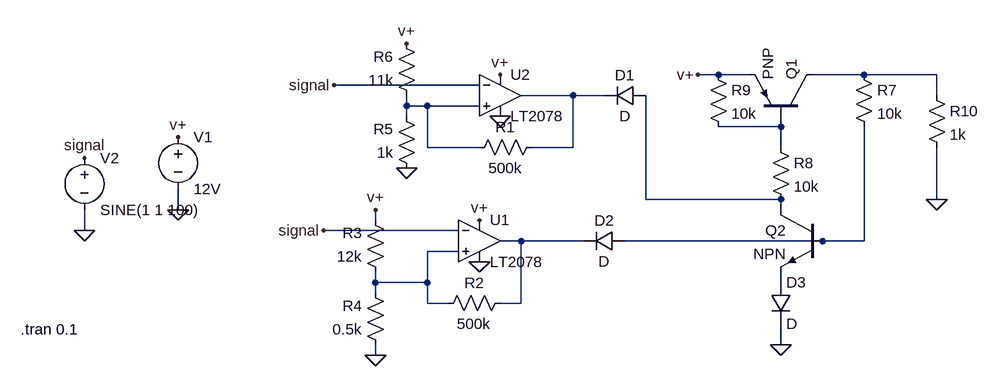
[diagram p0: schematic hystereresisbjt_latch.asc]
hystereresisbjt_latch.asc, the LTspice schematic file:
Version 4
SHEET 1 1124 680
WIRE 672 144 640 144
WIRE 720 144 672 144
WIRE 896 144 816 144
WIRE 1008 144 896 144
WIRE 304 160 80 160
WIRE 448 176 368 176
WIRE 496 176 448 176
WIRE 1008 176 1008 144
WIRE 192 192 192 176
WIRE 224 192 192 192
WIRE 304 192 224 192
WIRE 192 208 192 192
WIRE 768 224 768 208
WIRE 768 224 672 224
WIRE 224 256 224 192
WIRE 304 256 224 256
WIRE 448 256 448 176
WIRE 448 256 384 256
WIRE 768 256 768 224
WIRE 560 336 560 176
WIRE 768 336 560 336
WIRE 1008 336 1008 256
WIRE -160 352 -160 320
WIRE 768 352 768 336
WIRE 144 368 144 352
WIRE -304 384 -304 352
WIRE 272 384 64 384
WIRE 368 400 336 400
WIRE 464 400 368 400
WIRE 832 400 528 400
WIRE 896 400 896 224
WIRE 896 400 832 400
WIRE 272 416 224 416
WIRE 144 464 144 448
WIRE 224 464 224 416
WIRE 224 464 144 464
WIRE 768 464 768 448
WIRE 144 480 144 464
WIRE 224 496 224 464
WIRE 256 496 224 496
WIRE 368 496 368 400
WIRE 368 496 336 496
WIRE 768 560 768 528
WIRE 144 576 144 560
FLAG -160 352 0
FLAG 336 208 0
FLAG 304 432 0
FLAG -160 240 v+
FLAG 336 144 v+
FLAG 304 368 v+
FLAG 144 576 0
FLAG 192 288 0
FLAG 192 96 v+
FLAG 144 352 v+
FLAG 768 560 0
FLAG 1008 336 0
FLAG 640 144 v+
FLAG -304 384 0
FLAG -304 272 signal
FLAG 80 160 signal
FLAG 64 384 signal
SYMBOL Opamps\\LT2078 304 336 R0
SYMATTR InstName U1
SYMBOL Opamps\\LT2078 336 112 R0
SYMATTR InstName U2
SYMBOL voltage -160 224 R0
WINDOW 123 0 0 Left 2
WINDOW 39 0 0 Left 2
SYMATTR InstName V1
SYMATTR Value 12V
SYMBOL res 400 240 R90
WINDOW 0 0 56 VBottom 2
WINDOW 3 32 56 VTop 2
SYMATTR InstName R1
SYMATTR Value 500k
SYMBOL res 352 480 R90
WINDOW 0 0 56 VBottom 2
WINDOW 3 32 56 VTop 2
SYMATTR InstName R2
SYMATTR Value 500k
SYMBOL res 160 464 R180
WINDOW 0 36 76 Left 2
WINDOW 3 36 40 Left 2
SYMATTR InstName R3
SYMATTR Value 12k
SYMBOL res 160 576 R180
WINDOW 0 36 76 Left 2
WINDOW 3 36 40 Left 2
SYMATTR InstName R4
SYMATTR Value 0.5k
SYMBOL res 208 304 R180
WINDOW 0 36 76 Left 2
WINDOW 3 36 40 Left 2
SYMATTR InstName R5
SYMATTR Value 1k
SYMBOL res 208 192 R180
WINDOW 0 36 76 Left 2
WINDOW 3 36 40 Left 2
SYMATTR InstName R6
SYMATTR Value 11k
SYMBOL diode 560 160 R90
WINDOW 0 0 32 VBottom 2
WINDOW 3 32 32 VTop 2
SYMATTR InstName D1
SYMBOL diode 528 384 R90
WINDOW 0 0 32 VBottom 2
WINDOW 3 32 32 VTop 2
SYMATTR InstName D2
SYMBOL pnp 816 208 M270
SYMATTR InstName Q1
SYMBOL npn 832 352 M0
SYMATTR InstName Q2
SYMBOL res 880 128 R0
SYMATTR InstName R7
SYMATTR Value 10k
SYMBOL res 752 240 R0
SYMATTR InstName R8
SYMATTR Value 10k
SYMBOL res 656 128 R0
SYMATTR InstName R9
SYMATTR Value 10k
SYMBOL res 992 160 R0
SYMATTR InstName R10
SYMATTR Value 1k
SYMBOL voltage -304 256 R0
WINDOW 123 0 0 Left 2
WINDOW 39 0 0 Left 2
SYMATTR InstName V2
SYMATTR Value SINE(1 1 100)
SYMBOL diode 752 464 R0
SYMATTR InstName D3
TEXT -402 536 Left 2 !.tran 0.1

The netlist it stands for:
* hystereresisbjt_latch.asc
XU1 N008 signal v+ 0 N006 LT2078  ; pins In+ In- V+ V- OUT
XU2 N003 signal v+ 0 N002 LT2078  ; pins In+ In- V+ V- OUT
V1 v+ 0 12V
R1 N002 N003 500k
R2 N006 N008 500k
R3 N008 v+ 12k
R4 0 N008 0.5k
R5 0 N003 1k
R6 N003 v+ 11k
D1 N005 N002 D
D2 N007 N006 D
Q1 N001 N004 v+ 0 PNP
Q2 N005 N007 N009 0 NPN
R7 N001 N007 10k
R8 N004 N005 10k
R9 v+ N004 10k
R10 N001 0 1k
V2 signal 0 SINE(1 1 100)
D3 N009 0 D
.model D D
.lib standard.dio
.model NPN NPN
.model PNP PNP
.lib standard.bjt
.tran 0.1
.backanno
.end